# EasyEDA Pro project ProPrj_rtt_FOC_2025-11-25.epro

# Schematic Schematic1
Board Name: Board1; Create Date: 2025-11-04; Page Name: P1; Project Name: rtt_FOC; Schematic Name: Schematic1; Update Date: 2025-11-04; Company: 嘉立创EDA; Page Size: A4; Version: V1.0
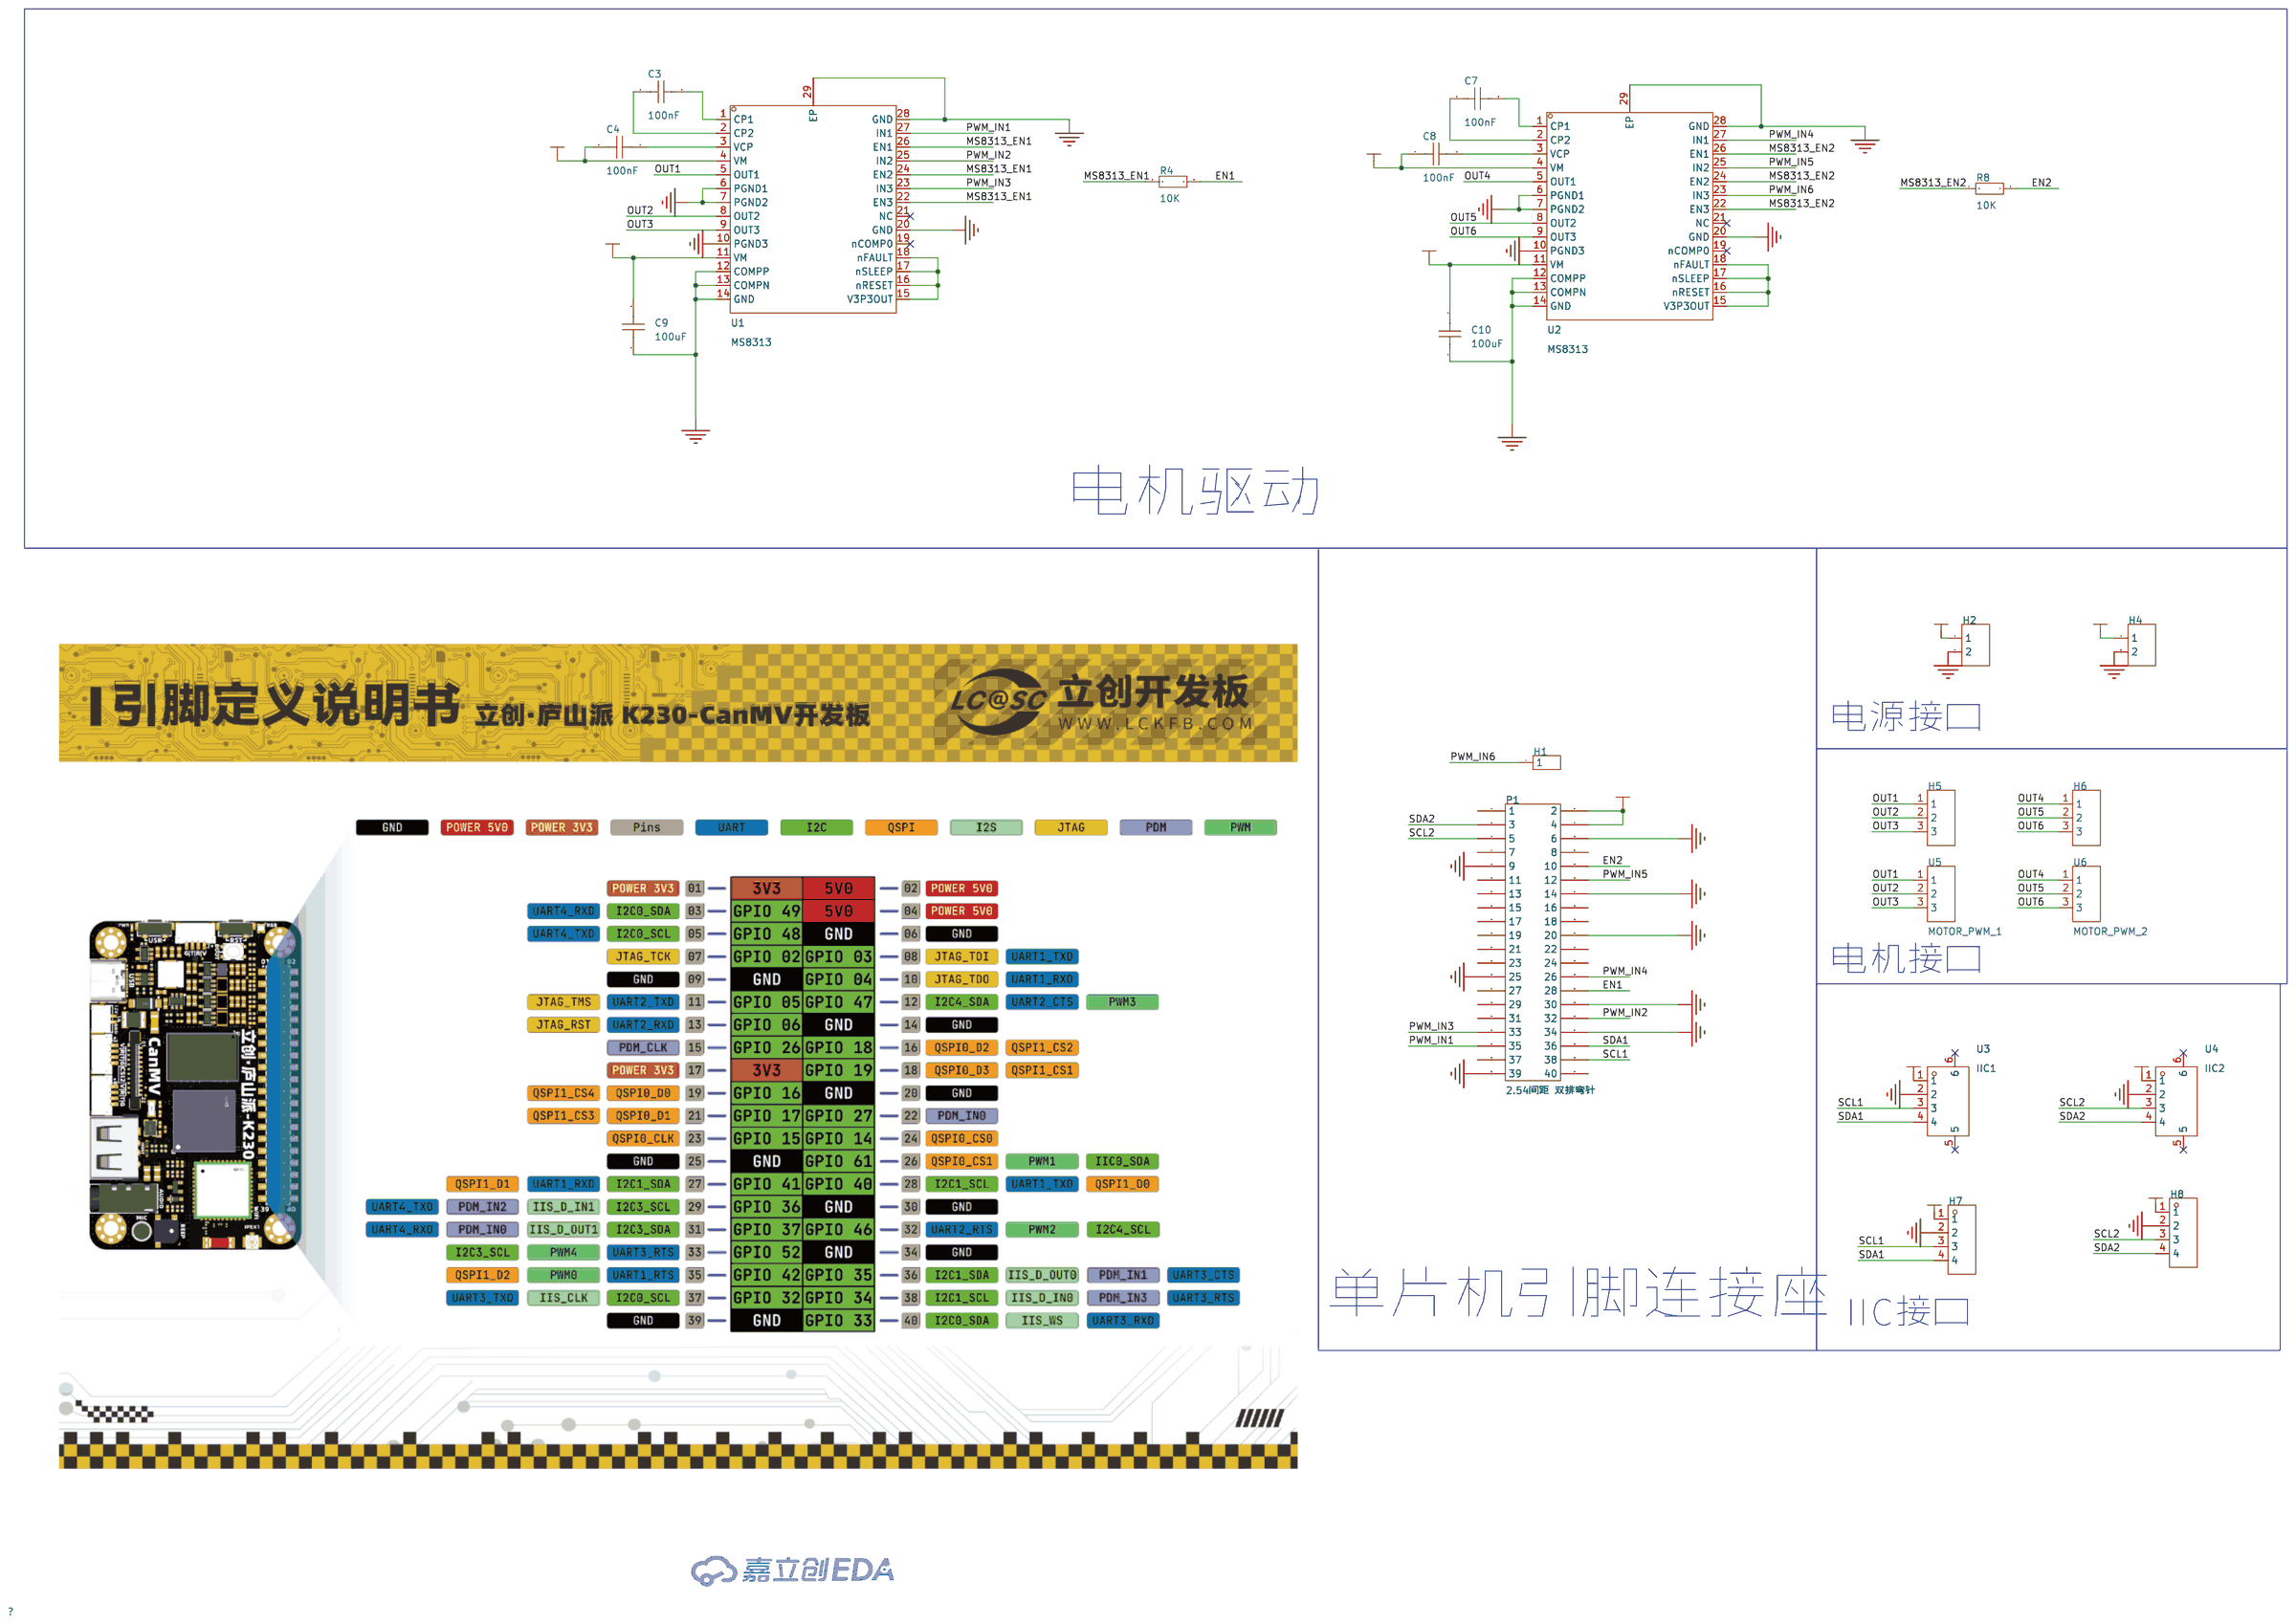
[diagram p0: schematic sheet]

## Parts
C3  100nF  [C0603]
C4  100nF  [C0603]
C7  100nF  [C0603]
C8  100nF  [C0603]
C9  100uF  [C1206]
C10  100uF  [C1206]
H1  -  [HDR-TH_1P-V-M_XKB_X4611WV-01I-C28D40]
H2  -  [HDR-TH_2P-P2.54-V-F]
H4  -  [HDR-TH_2P-P2.54-V-F]
H5  -  [HDR-TH_3P-P2.54-V-F]
H6  -  [HDR-TH_3P-P2.54-V-F]
H7  -  [HDR-TH_4P-P2.54-V-F]
H8  -  [HDR-TH_4P-P2.54-V-F]
P1  2.54间距 双排弯针  [HDR-TH_20P-P2.54-H-R2-C10-S2.54-W12.0]
R4  10K  [R0603]
R8  10K  [R0603]
U1  MS8313  [HTSSOP-28_L9.7-W4.4-P0.65-LS6.4-BL-EP]
U2  MS8313  [HTSSOP-28_L9.7-W4.4-P0.65-LS6.4-BL-EP]
U3  IIC1  [CONN-SMD_4P-P1.25_XUNPU_WAFER-GH1.25-4PWB]
U4  IIC2  [CONN-SMD_4P-P1.25_XUNPU_WAFER-GH1.25-4PWB]
U5  MOTOR_PWM_1  [CONN-TH_3P-P1.25_BX-MX1.25-3PWZ]
U6  MOTOR_PWM_2  [CONN-TH_3P-P1.25_BX-MX1.25-3PWZ]

## Library data of the parts
C3 C4 C7 C8 = CAP_0603: Supplier Footprint: 0603
C9 C10 = CAP_1206: Supplier Footprint: 1206
H1 = HDR-M_2.54_1x1P: Supplier Part: C81276; Supplier Footprint: 插件; JLCPCB Part Class: Extended Part
H2 H4 = HDR-F_2.54_1x2P: Supplier Part: C49661; Supplier Footprint: 插件
H5 H6 = HDR-F_2.54_1x3P: Supplier Part: C541850; Supplier Footprint: 插件
H7 H8 = HDR-F_2.54_1x4P: Supplier Part: C2718488; Supplier Footprint: 插件
P1 = 2.54间距 双排弯针: 圆针/方针:-;额定电流:-;额定电压:-;配合针长度:-;塑高:-;触头材质:-;; LCSC Part Name: 2.54mm 2*20P 弯 排针; Supplier Part: C42157; Supplier Footprint: 2x20P; JLCPCB Part Class: 扩展库; Supplier: LCSC
R4 R8 = Res_0603: Supplier Footprint: 0603
U1 U2 = MS8313: 三个独立半桥大电流驱动 MS8313提供三个可独立控制的半H桥驱动器。可被用于驱动螺线管或者其他负载，但它主要用于驱动一个三相无刷直流电机。每个输出驱动器通道包含采用半H桥配置的N通道功率MOSFET。; LCSC Part Name: 2.5A 36V电机驱动芯片; Supplier Part: C231942; Manufacturer: 杭州瑞盟; Supplier Footprint: HTSSOP-28-EP; JLCPCB Part Class: 扩展库; Datasheet: https://item.szlcsc.com/datasheet/MS8313/231840.html; Supplier: LCSC; Drive Type: 三相; Number of Half Bridges: 3; Output Current: 1.75A; Peak Current: 2.5A; RDS(on): 240mΩ; Operating Temperature: -40℃~+150℃
U3 U4 = WAFER-GH1.25-4PWB: 插针结构:1x4P;间距:1.25mm;安装方式:卧贴;参考系列:GH;总PIN数:4P;排数:1;每排PIN数:4;行距:-;额定电流:1A;触头材质:黄铜;触头镀层:锡;工作温度:-25℃~+85℃;; LCSC Part Name: 1x4P 间距:1.25mm 卧贴 系列:GH; Supplier Part: C3029379; Manufacturer: XUNPU(讯普); Supplier Footprint: SMD,P=1.25mm,卧贴; JLCPCB Part Class: 扩展库; Datasheet: https://item.szlcsc.com/datasheet/WAFER-GH1.25-4PWB/3561391.html; Supplier: LCSC; Pins Structure: 1x4P; Pitch: 1.25mm; Mounting Type: 卧贴; Reference Series: GH; Number of Pins: 4P; Number of Rows: 1; Number of PINs Per Row: 4; Current Rating: 1A; Contact Material: 黄铜; Contact Plating: 锡; Operating Temperature: -25℃~+85℃; Voltage Rating: 125V; Plastic Material: LCP; Supplementary Features: 辅助焊脚; Color: 米色; Z-Height of the Board: 4.35mm; X-Length of Bottom Edge on Board (Spacing Line): 8.25mm; Y-Width of Bottom Edge on Board: 5mm
U5 U6 = BX-MX1.25-3PWZ_C9900098197: LCSC Part Name: BX-MX1.25-3PWZ; Supplier Part: C9900098197; JLCPCB Part Class: 扩展库; Supplier: LCSC

## Nets
5V: H7.1 H8.1 P1.2 P1.4 U3.1 U4.1
12.6V: C4.1 C8.1 C9.2 C10.2 H2.1 H4.1 U1.4(VM) U1.11(VM) U2.4(VM) U2.11(VM)
GND: C9.1 C10.1 H2.2 H4.2 H7.2 H8.2 P1.6 P1.9 P1.14 P1.20 P1.25 P1.30 P1.34 P1.39 U1.6(PGND1) U1.7(PGND2) U1.10(PGND3) U1.12(COMPP) U1.13(COMPN) U1.14(GND) U1.20(GND) U1.28(GND) U1.29(EP) U2.6(PGND1) U2.7(PGND2) U2.10(PGND3) U2.12(COMPP) U2.13(COMPN) U2.14(GND) U2.20(GND) U2.28(GND) U2.29(EP) U3.2 U4.2
EN1: P1.28 R4.2
EN2: P1.10 R8.2
MS8313_EN1: R4.1 U1.22(EN3) U1.24(EN2) U1.26(EN1)
MS8313_EN2: R8.1 U2.22(EN3) U2.24(EN2) U2.26(EN1)
OUT1: H5.1 U1.5(OUT1) U5.1
OUT2: H5.2 U1.8(OUT2) U5.2
OUT3: H5.3 U1.9(OUT3) U5.3
OUT4: H6.1 U2.5(OUT1) U6.1
OUT5: H6.2 U2.8(OUT2) U6.2
OUT6: H6.3 U2.9(OUT3) U6.3
PWM_IN1: P1.35 U1.27(IN1)
PWM_IN2: P1.32 U1.25(IN2)
PWM_IN3: P1.33 U1.23(IN3)
PWM_IN4: P1.26 U2.27(IN1)
PWM_IN5: P1.12 U2.25(IN2)
PWM_IN6: H1.1 U2.23(IN3)
SCL1: H7.3 P1.38 U3.3
SCL2: H8.3 P1.5 U4.3
SDA1: H7.4 P1.36 U3.4
SDA2: H8.4 P1.3 U4.4
$1N1342: C3.2 U1.1(CP1)
$1N1351: C3.1 U1.2(CP2)
$1N1408: C4.2 U1.3(VCP)
$1N1950: U2.15(V3P3OUT) U2.16(nRESET) U2.17(nSLEEP) U2.18(nFAULT)
$1N1993: C7.2 U2.1(CP1)
$1N2006: C7.1 U2.2(CP2)
$1N2009: C8.2 U2.3(VCP)
$1N4523: U1.15(V3P3OUT) U1.16(nRESET) U1.17(nSLEEP) U1.18(nFAULT)

Not connected (* = marked no-connect by the designer): P1 1 7 8 11 13 15 16 17 18 19 21 22 23 24 27 29 31 37 40; U1 19(nCOMP0)* 21(NC)*; U2 19(nCOMP0)* 21(NC)*; U3 5* 6*; U4 5* 6*

## Notes on the sheet
- 电机驱动
- 电源接口
- 电机接口
- 单片机引脚连接座
- IIC接口

# Board PCB1
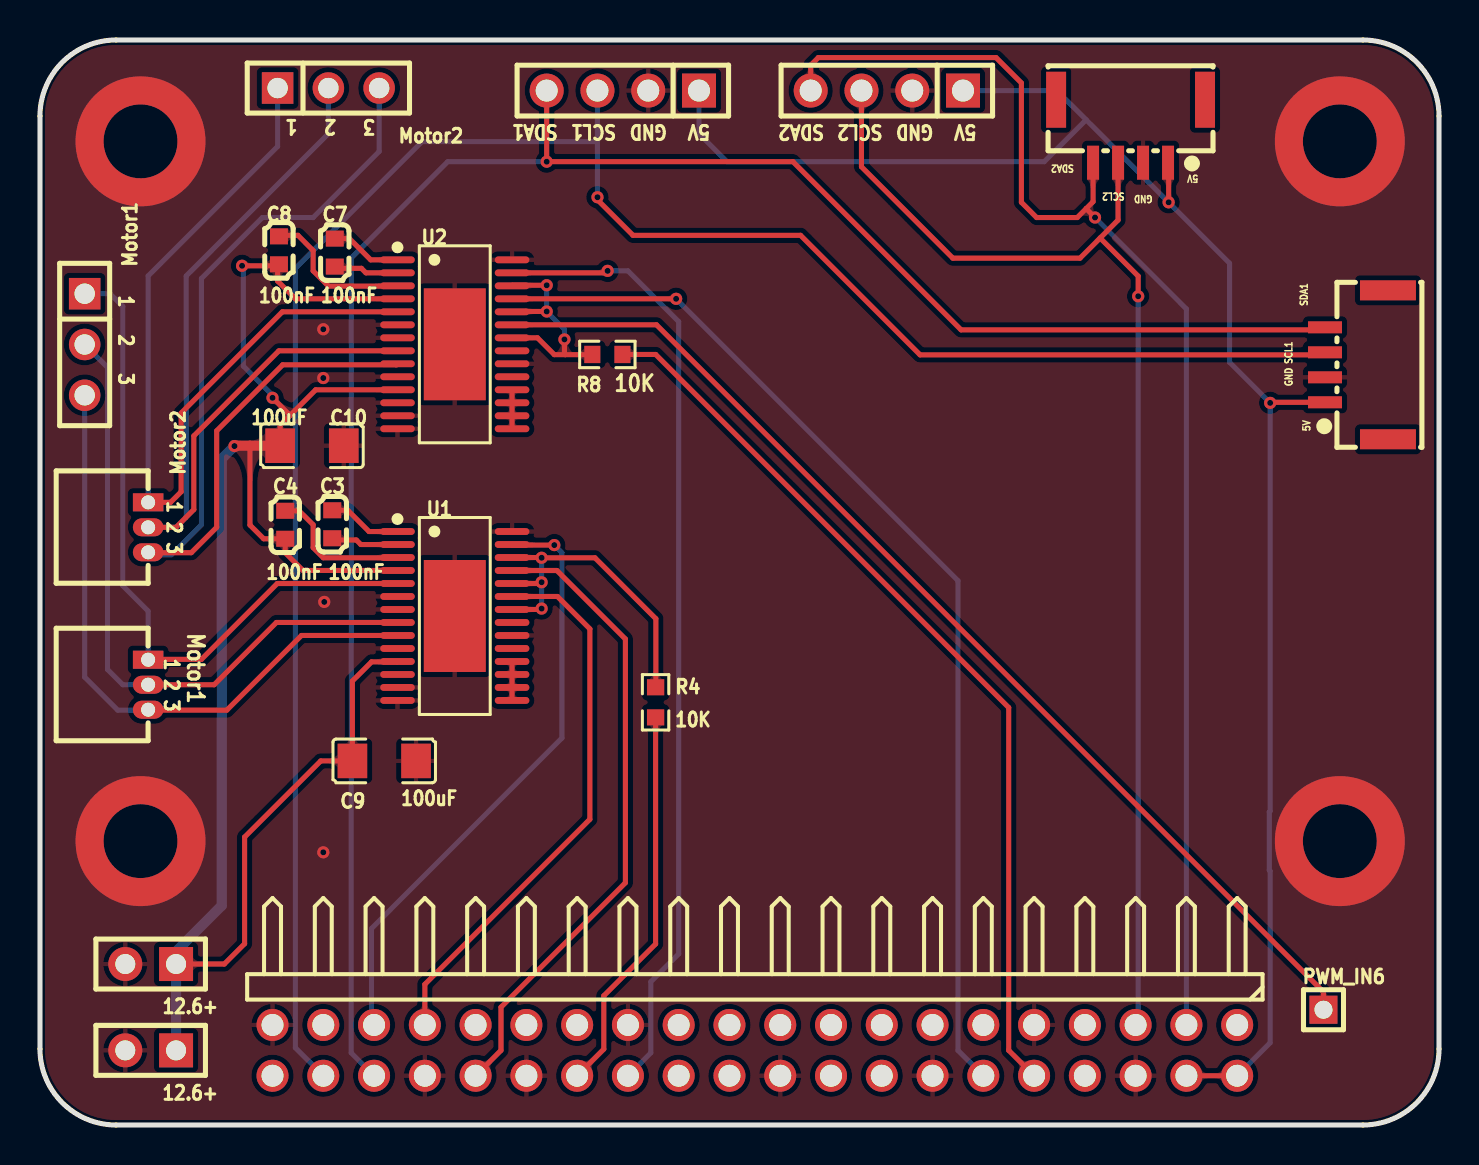
[diagram p1: board, top side]
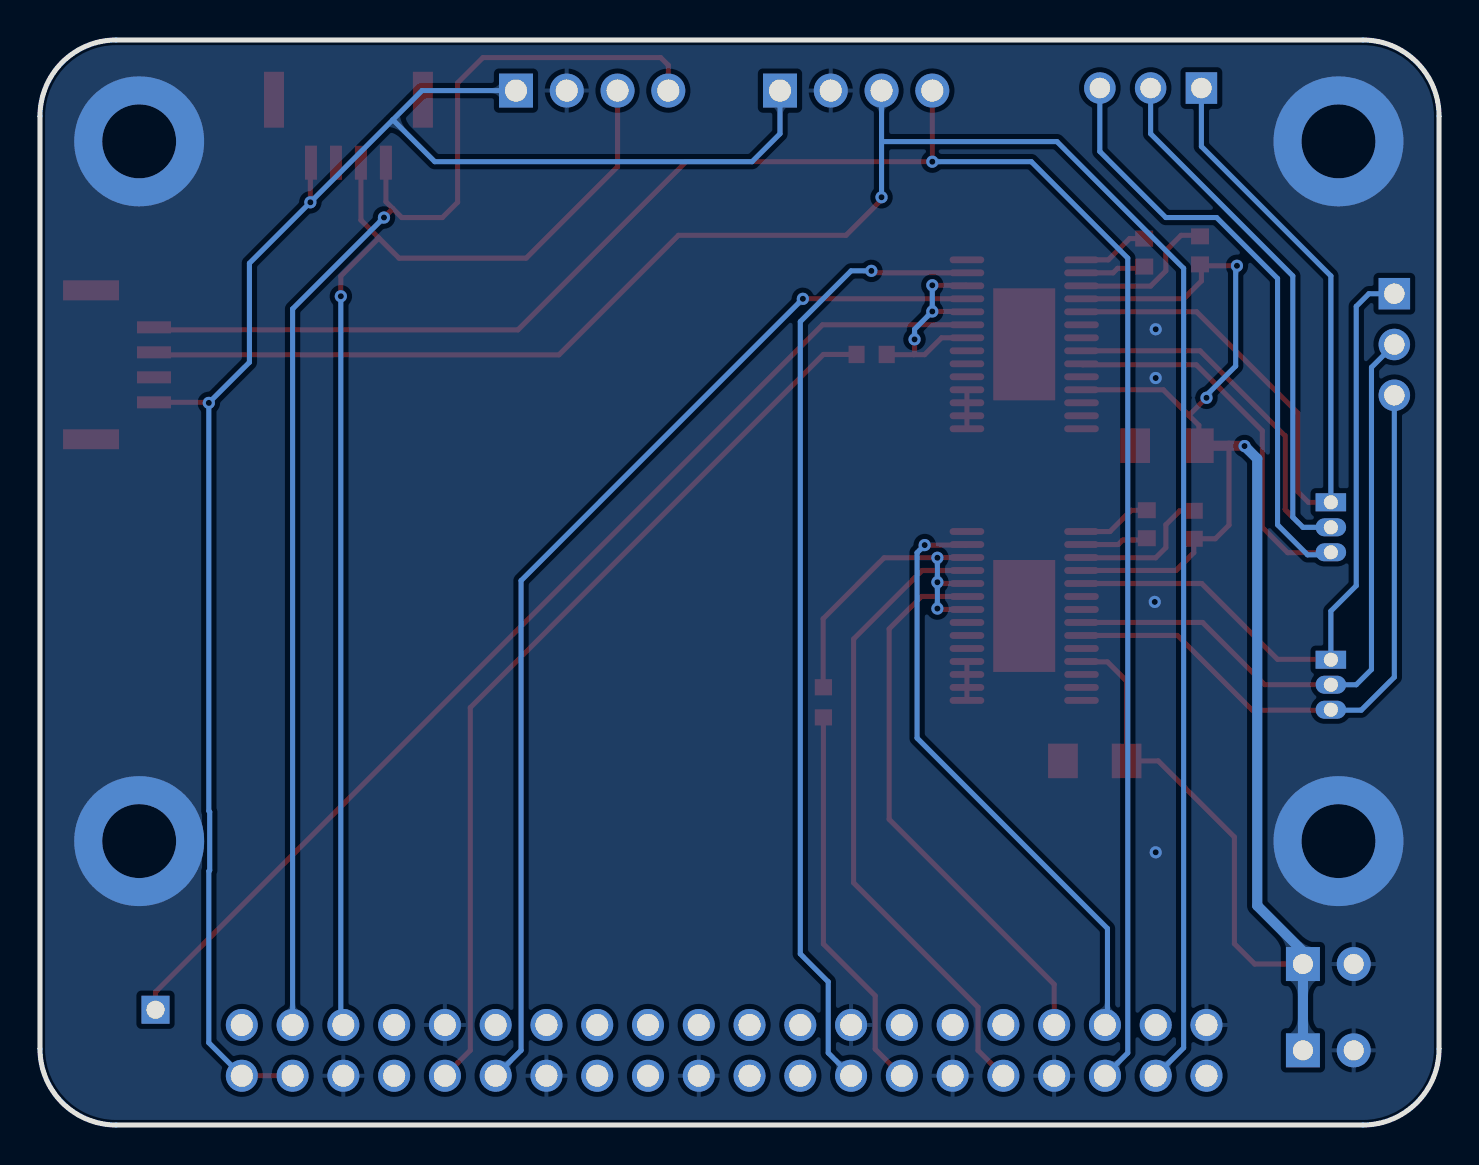
[diagram p2: board, bottom side, seen from below]

Outline 69.99 x 54.27 mm; copper layers: Top Layer, Bottom Layer. Coordinates in mm from the lower left corner of the outline.
Outline path: 0,50.46 0,3.81 arc(1.12,1.12) 3.81,0 66.18,0 arc(68.88,1.12) 69.99,3.81 69.99,50.46 arc(68.88,53.16) 66.18,54.27 3.81,54.27 arc(1.12,53.16) 0,50.46
Stack: Top Layer 0.035mm / Dielectric1 1.51mm FR4 er 4.5 / Bottom Layer 0.035mm

## Design rules (mm)
template: JLCPCB Capability(Two Layers Board)
spacing copperThickness1oz (default): track to track 0.102, other pairs 0.152 to 0.3
spacing copperThickness2oz: track to track 0.203, other pairs 0.152 to 0.3
track width copperThickness1oz (default): min 0.127, default 0.254, max 2.54
track width copperThickness2oz: min 0.203, default 0.254, max 2.54
differential pair differentialPair (default): width min 0.127, default 0.254, max 2.54; gap min 0.152, default 0.152
via viaSize (default): diameter min 0.5, default 0.61, max 10; hole min 0.3, default 0.305, max 6.3

## Placement (name value [footprint] x y rotation side)
C3  100nF  [C0603]  14.62 30.05 90 top
C4  100nF  [C0603]  12.27 30.02 90 top
C7  100nF  [C0603]  14.75 43.64 90 top
C8  100nF  [C0603]  11.96 43.75 90 top
C9  100uF  [C1206]  17.22 18.21 180 top
C10  100uF  [C1206]  13.61 33.98 180 top
H2  -  [HDR-TH_2P-P2.54-V-F]  5.54 3.73 180 top
H4  -  [HDR-TH_2P-P2.54-V-F]  5.54 8.05 180 top
H7  -  [HDR-TH_4P-P2.54-V-F]  29.16 51.74 180 top
H8  -  [HDR-TH_4P-P2.54-V-F]  42.37 51.74 180 top
Motor1  -  [HDR-TH_3P-P2.54-V-F]  2.24 39.04 270 top
Motor2  -  [HDR-TH_3P-P2.54-V-F]  14.43 51.87 0 top
Motor2#2  -  [CONN-TH_3P-P1.25_BX-MX1.25-3PWZ]  5.41 29.9 270 top
P1  2.54间距 双排弯针  [HDR-TH_20P-P2.54-H-R2-C10-S2.54-W12.0]  35.76 3.73 270 top
PWM_IN6  -  [HDR-TH_1P-V-M_XKB_X4611WV-01I-C28D40]  64.21 5.77 0 top
R4  10K  [R0603]  30.8 21.14 270 top
R8  10K  [R0603]  28.39 38.54 0 top
U1  MS8313  [HTSSOP-28_L9.7-W4.4-P0.65-LS6.4-BL-EP]  20.75 25.46 270 top
U2  MS8313  [HTSSOP-28_L9.7-W4.4-P0.65-LS6.4-BL-EP]  20.75 39.05 270 top
U3  IIC1  [CONN-SMD_4P-P1.25_XUNPU_WAFER-GH1.25-4PWB]  65.86 38.02 90 top
U4  IIC2  [CONN-SMD_4P-P1.25_XUNPU_WAFER-GH1.25-4PWB]  54.56 49.71 180 top
U5  MOTOR_PWM_1  [CONN-TH_3P-P1.25_BX-MX1.25-3PWZ]  5.41 22.02 270 top

## Footprints (pads in the part's own frame, mm; a bottom-side part is the same pattern mirrored in y, then rotated)
C0603
  rect 0.8x0.9 smd: 1(-0.7,0) 2(0.7,0)
C1206
  rect 1.485x1.728 smd: 1(-1.593,0) 2(1.593,0)
CONN-SMD_4P-P1.25_XUNPU_WAFER-GH1.25-4PWB
  rect 0.6x1.7 smd: 1(-1.875,1.575) 2(-0.625,1.575) 3(0.625,1.575) 4(1.875,1.575)
  rect 1x2.8 smd: 5(3.725,-1.575) 6(-3.725,-1.575)
CONN-TH_3P-P1.25_BX-MX1.25-3PWZ
  rect 0.9x1.524 hole 0.7: 1(-1.25,0)
  oval 0.9x1.524 hole 0.7: 2(0,0) 3(1.25,0)
HDR-TH_1P-V-M_XKB_X4611WV-01I-C28D40
  rect 1.4x1.4 hole 0.9: 1(0,0)
HDR-TH_2P-P2.54-V-F
  rect 1.7x1.7 hole 1: 1(-1.27,0)
  round 1.7 hole 1: 2(1.27,0)
HDR-TH_3P-P2.54-V-F
  rect 1.575x1.575 hole 1.02: 1(-2.54,0)
  round 1.575 hole 1.02: 2(0,0) 3(2.54,0)
HDR-TH_4P-P2.54-V-F
  rect 1.7x1.7 hole 1.1: 1(-3.81,0)
  round 1.7 hole 1.1: 2(-1.27,0) 3(1.27,0) 4(3.81,0)
HDR-TH_20P-P2.54-H-R2-C10-S2.54-W12.0
  round 1.6 hole 1.1: 1(-1.27,24.13) 2(1.27,24.13) 3(-1.27,21.59) 4(1.27,21.59) 5(-1.27,19.05) 6(1.27,19.05) 7(-1.27,16.51) 8(1.27,16.51) 9(-1.27,13.97) 10(1.27,13.97) 11(-1.27,11.43) 12(1.27,11.43) 13(-1.27,8.89) 14(1.27,8.89) 15(-1.27,6.35) 16(1.27,6.35) 17(-1.27,3.81) 18(1.27,3.81) 19(-1.27,1.27) 20(1.27,1.27) 21(-1.27,-1.27) 22(1.27,-1.27) 23(-1.27,-3.81) 24(1.27,-3.81) 25(-1.27,-6.35) 26(1.27,-6.35) 27(-1.27,-8.89) 28(1.27,-8.89) 29(-1.27,-11.43) 30(1.27,-11.43) 31(-1.27,-13.97) 32(1.27,-13.97) 33(-1.27,-16.51) 34(1.27,-16.51) 35(-1.27,-19.05) 36(1.27,-19.05) 37(-1.27,-21.59) 38(1.27,-21.59) 39(-1.27,-24.13) 40(1.27,-24.13)
HTSSOP-28_L9.7-W4.4-P0.65-LS6.4-BL-EP
  oval 0.343x1.732 smd: 1(-4.225,-2.866) 2(-3.575,-2.866) 3(-2.925,-2.866) 4(-2.275,-2.866) 5(-1.625,-2.866) 6(-0.975,-2.866) 7(-0.325,-2.866) 8(0.325,-2.866) 9(0.975,-2.866) 10(1.625,-2.866) 11(2.275,-2.866) 12(2.925,-2.866) 13(3.575,-2.866) 14(4.225,-2.866) 15(4.225,2.866) 16(3.575,2.866) 17(2.925,2.866) 18(2.275,2.866) 19(1.625,2.866) 20(0.975,2.866) 21(0.325,2.866) 22(-0.325,2.866) 23(-0.975,2.866) 24(-1.625,2.866) 25(-2.275,2.866) 26(-2.925,2.866) 27(-3.575,2.866) 28(-4.225,2.866)
  rect 5.6x3.1 smd: 29(0,0)
R0603
  rect 0.806x0.864 smd: 1(-0.753,0) 2(0.753,0)

## Nets
5V: H7.1 H8.1 P1.2 P1.4 U3.1 U4.1
12.6V: C4.1 C8.1 C9.2 C10.2 H2.1 H4.1 U1.4 U1.11 U2.4 U2.11
GND: C9.1 C10.1 H2.2 H4.2 H7.2 H8.2 P1.6 P1.9 P1.14 P1.20 P1.25 P1.30 P1.34 P1.39 U1.6 U1.7 U1.10 U1.12 U1.13 U1.14 U1.20 U1.28 U1.29 U2.6 U2.7 U2.10 U2.12 U2.13 U2.14 U2.20 U2.28 U2.29 U3.2 U4.2
EN1: P1.28 R4.2
EN2: P1.10 R8.2
MS8313_EN1: R4.1 U1.22 U1.24 U1.26
MS8313_EN2: R8.1 U2.22 U2.24 U2.26
OUT1: Motor1.1 U1.5 U5.1
OUT2: Motor1.2 U1.8 U5.2
OUT3: Motor1.3 U1.9 U5.3
OUT4: Motor2.1 Motor2#2.1 U2.5
OUT5: Motor2.2 Motor2#2.2 U2.8
OUT6: Motor2.3 Motor2#2.3 U2.9
PWM_IN1: P1.35 U1.27
PWM_IN2: P1.32 U1.25
PWM_IN3: P1.33 U1.23
PWM_IN4: P1.26 U2.27
PWM_IN5: P1.12 U2.25
PWM_IN6: PWM_IN6.1 U2.23
SCL1: H7.3 P1.38 U3.3
SCL2: H8.3 P1.5 U4.3
SDA1: H7.4 P1.36 U3.4
SDA2: H8.4 P1.3 U4.4
$1N1342: C3.2 U1.1
$1N1351: C3.1 U1.2
$1N1408: C4.2 U1.3
$1N1950: U2.15 U2.16 U2.17 U2.18
$1N1993: C7.2 U2.1
$1N2006: C7.1 U2.2
$1N2009: C8.2 U2.3
$1N4523: U1.15 U1.16 U1.17 U1.18

Pads without a net: P1 1 7 8 11 13 15 16 17 18 19 21 22 23 24 27 29 31 37 40; U1 19 21; U2 19 21; U3 5 6; U4 5 6

## Via types
v1: diameter 6.5, hole 3.7, Top Layer to Bottom Layer, 4 vias
v2: diameter 0.61, hole 0.305, Top Layer to Bottom Layer, 22 vias

## Routing (per net, layer and track width the routed paths; a pad name or vN(x,y) marks a point on that pad's centre or on a via; arc(x,y) is an arc through that point)
5V: length 89.4
  Top Layer w0.254: U4.1 56.47,48.1 v2(56.47,46.15) ; P1.4 P1.2 ; v2(61.55,36.12) 61.58,36.15 U3.1
  Bottom Layer w0.254: 52.34,50.28 50.24,48.18 34.37,48.18 32.97,49.58 H7.1 ; 52.34,50.28 50.88,51.74 H8.1 ; 52.34,50.28 v2(56.47,46.15) 59.51,43.1 59.51,38.15 v2(61.55,36.12) 61.55,15.71 61.5,15.66 61.5,12.74 61.55,12.69 61.55,4.11 P1.2
12.6V: length 94.4
  Top Layer w0.254: 11.89,42.98 C8.1 ; 11.89,42.98 11.89,42.21 12.78,41.32 U2.4 ; 11.89,42.98 11.88,42.98 v2(10.11,42.98) ; v2(11.63,36.37) 12.51,35.5 12.51,35.49 ; 12.51,35.49 12.01,35 C10.2 ; 12.51,35.49 13.79,36.77 U2.11 ; 17.89,27.74 13.16,27.74 12.27,28.63 C4.1 11.19,29.32 10.51,30.01 10.51,33.98 ; U1.11 17.87,23.16 16.59,23.16 15.63,22.21 C9.2 14.05,18.21 10.24,14.4 10.24,9.07 9.22,8.05 H4.1
  Top Layer w0.508: C10.2 9.75,33.98 v2(9.73,33.96)
  Bottom Layer w0.254: v2(10.11,42.98) 10.17,42.91 10.17,37.96 11.63,36.5 v2(11.63,36.37)
  Bottom Layer w0.508: v2(9.73,33.96) 9.09,33.32 9.09,10.97 6.81,8.69 H4.1 H2.1
GND:
  vias: v1(5.03,49.2) v1(5.03,14.2) v1(65.03,49.2) v1(65.03,14.2) v2(14.17,39.8) v2(14.17,37.36) v2(14.22,26.16) v2(14.17,13.64)
EN1: length 19.6
  Top Layer w0.254: R4.2 30.8,9.06 28.21,6.46 28.21,3.8 P1.28
EN2: length 45.6
  Top Layer w0.254: R8.2 30.8,38.54 48.46,20.88 48.46,3.73 P1.10
MS8313_EN1: length 17.4
  Top Layer w0.254: U1.22 25.05,25.79 v2(25.1,25.83) ; v2(25.1,27.15) 25.03,27.09 U1.24 ; U1.26 25.08,28.39 v2(25.1,28.37) 27.76,28.37 30.81,25.32 30.81,21.91 30.8,21.9
  Bottom Layer w0.254: v2(25.1,25.83) v2(25.1,27.15) v2(25.1,28.37)
MS8313_EN2: length 11.7
  Top Layer w0.254: 26.28,38.53 26.24,38.57 v2(26.24,39.29) ; 26.28,38.53 27.62,38.53 R8.1 ; 26.28,38.53 25.73,38.53 24.89,39.37 U2.22 ; U2.26 23.65,42 v2(25.35,42) ; U2.24 23.63,40.69 v2(25.35,40.69)
  Bottom Layer w0.254: v2(25.35,42) v2(25.35,40.69) 26.24,39.8 v2(26.24,39.29)
OUT1: length 34.4
  Top Layer w0.254: U1.5 11.87,27.09 8.08,23.29 5.43,23.29 U5.1
  Bottom Layer w0.254: U5.1 5.41,25.7 4.14,26.97 4.14,40.94 3.51,41.58 Motor1.1
OUT2: length 32.8
  Top Layer w0.254: U1.8 11.83,25.14 8.71,22.02 U5.2
  Bottom Layer w0.254: U5.2 4.14,22.02 3.38,22.78 3.38,37.9 Motor1.2
OUT3: length 32
  Top Layer w0.254: U5.3 5.67,20.77 5.69,20.75 9.35,20.75 13.08,24.49 U1.9
  Bottom Layer w0.254: U5.3 5.39,20.75 3.89,20.75 2.24,22.4 Motor1.3
OUT4: length 42.1
  Top Layer w0.254: U2.5 12.13,40.67 7.06,35.61 7.06,31.67 6.53,31.15 Motor2#2.1
  Bottom Layer w0.254: Motor2.1 11.89,48.95 5.41,42.47 Motor2#2.1
OUT5: length 44.8
  Top Layer w0.254: Motor2#2.2 6.81,29.9 7.7,30.78 7.7,34.47 11.95,38.72 U2.8
  Bottom Layer w0.254: Motor2#2.2 6.81,29.9 7.32,30.4 7.32,42.47 14.43,49.58 Motor2.2
OUT6: length 49.6
  Top Layer w0.254: Motor2#2.3 5.43,28.63 7.57,28.63 8.84,29.9 8.84,34.72 12.14,38.02 17.84,38.02 U2.9
  Bottom Layer w0.254: Motor2.3 16.97,48.69 13.67,45.39 11.13,45.39 8.08,42.34 8.08,30.02 6.57,28.52 5.54,28.52 Motor2#2.3
PWM_IN1: length 30.3
  Top Layer w0.254: U1.27 23.65,29.01 v2(25.73,29.01)
  Bottom Layer w0.254: v2(25.73,29.01) 26.11,28.63 26.11,19.35 16.59,9.83 16.59,5.13 P1.35
PWM_IN2: length 32
  Top Layer w0.254: U1.25 25.86,27.74 29.29,24.31 29.29,12.12 23.06,5.89 23.06,3.73 P1.32
PWM_IN3: length 27.8
  Top Layer w0.254: P1.33 19.25,7.04 27.51,15.29 27.51,24.82 25.89,26.44 U1.23
PWM_IN4: length 48.2
  Top Layer w0.254: v2(28.4,42.72) 28.3,42.62 U2.27
  Bottom Layer w0.254: v2(28.4,42.72) 29.41,42.72 31.95,40.18 31.95,8.56 30.56,7.16 30.56,3.61 P1.26
PWM_IN5: length 53.4
  Top Layer w0.254: U2.25 v2(31.83,41.32)
  Bottom Layer w0.254: v2(31.83,41.32) 45.92,27.23 45.92,3.73 P1.12
PWM_IN6: length 55.3
  Top Layer w0.254: U2.23 30.84,40.02 64.21,6.65 PWM_IN6.1
SCL1: length 103.8
  Top Layer w0.254: 64.29,38.52 44.03,38.52 38.05,44.5 29.67,44.5 27.89,46.28 v2(27.89,46.41)
  Bottom Layer w0.254: v2(27.89,46.41) 27.89,49.19 ; 27.89,49.19 19.12,49.19 12.78,42.85 12.78,3.86 P1.38 ; 27.89,49.19 H7.3
SCL2: length 62.4
  Top Layer w0.254: 53.04,44.36 52.03,43.36 45.67,43.36 41.1,47.93 H8.3 ; 53.04,44.36 53.94,45.26 U4.3 ; 53.04,44.36 54.94,42.46 v2(54.94,41.45)
  Bottom Layer w0.254: P1.5 54.94,5.13 v2(54.94,41.45)
SDA1: length 99.1
  Top Layer w0.254: H7.4 v2(25.35,48.18) 37.67,48.18 46.08,39.77 64.29,39.77
  Bottom Layer w0.254: v2(25.35,48.18) 20.4,48.18 15.57,43.36 15.57,3.61 P1.36
SDA2: length 67.6
  Top Layer w0.254: H8.4 38.56,53.01 38.94,53.39 47.83,53.39 49.1,52.12 49.1,46.15 49.86,45.39 51.89,45.39 52.34,45.84 ; 52.34,45.84 52.34,45.83 v2(52.78,45.39) ; 52.34,45.84 52.69,46.18 U4.4
  Bottom Layer w0.254: P1.3 57.35,40.82 v2(52.78,45.39)
$1N1342: length 3.7
  Top Layer w0.254: C3.2 15.4,30.75 16.46,29.69 U1.1
$1N1351: length 3.4
  Top Layer w0.254: C3.1 14.71,29.26 15.83,29.26 16.05,29.04 U1.2
$1N1408: length 7.3
  Top Layer w0.254: U1.3 17.87,28.37 14.17,28.37 13.67,28.88 13.67,30.02 12.97,30.72 C4.2
$1N1950: length 2
  Top Layer w0.254: U2.15 U2.16 U2.17 U2.18
$1N1993: length 3.6
  Top Layer w0.254: U2.1 16.54,43.27 15.48,44.34 C7.2
$1N2006: length 3.3
  Top Layer w0.254: C7.1 14.84,42.85 16.08,42.85 16.3,42.62 U2.2
$1N2009: length 7.6
  Top Layer w0.254: U2.3 17.87,41.96 14.43,41.96 13.67,42.72 13.67,43.74 12.9,44.5 12.01,44.5 C8.2
$1N4523: length 2
  Top Layer w0.254: U1.18 U1.17 U1.16 U1.15

## Copper pours and planes (outline as drawn; the poured copper is in the pictures)
GND on Top Layer: -2.34,55.3 73.86,55.3 73.86,-1.85 -2.34,-1.85
GND on Top Layer: -5.89,57.71 77.04,57.71 77.04,-1.6 -5.89,-1.6
GND on Bottom Layer: -1.83,55.8 73.48,55.8 73.48,-1.73 -1.83,-1.73

Small or netless copper shapes (teardrops, artwork), in the pictures only: 77 on Top Layer, 30 on Bottom Layer

## Text on the board
Top Silkscreen Layer: SDA2 | SCL2 | GND | 5V | SCL1 | SDA1 | 100uF | 100nF | 10K | 12.6+ | 1   2   3 | 1 2 3 | 3   2   1 | Motor1
